# Altium schematic sheet CAN_5V.SchDoc
size A
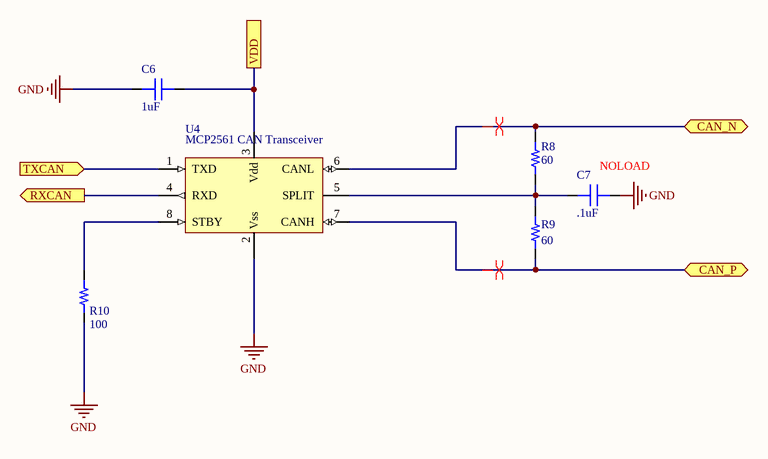
[diagram p0: CAN_5V.SchDoc]

## Parts
C6  capacitance: 1uF  [0603]  (hidden comment: capacitor)
C7  capacitance: .1uF  [0603]  (hidden comment: capacitor)
R8  60  [RES 0603/1608]
R9  60  [RES 0603/1608]
R10  100  [RES 0603/1608]
U4  MCP2561 CAN Transceiver  [SOIC-8]

## Ports
CAN_N (bidir), CAN_P (bidir), RXCAN (out), TXCAN (in), VDD

## Nets
GND: C6.1 C7.2 R10.2 U4.2(Vss)
CAN_N: R8.2 U4.6(CANL) ; port CAN_N
CAN_P: R9.2 U4.7(CANH) ; port CAN_P
RXCAN: U4.4(RXD) ; port RXCAN
TXCAN: U4.1(TXD) ; port TXCAN
VDD: C6.2 U4.3(Vdd) ; port VDD
NetC7_1: C7.1 R8.1 R9.1 U4.5(SPLIT)
NetR10_1: R10.1 U4.8(STBY)

## Layout directives
differential pair: CAN_N, CAN_P

## Notes on the sheet
- (near C7) NOLOAD

## Library data of the parts
C6 C7 = 1: Generic 0603 capacitor; id: 1; voltage: 50; dielectric: Ceramic; percent tolerance: 10; name: 0603 Capacitor; ESR: 1; package: 0603; quantity: 0
R8-R10 = 1: id: 1; name: 0603 Resistor; percent tolerance: 5; package: 0603; quantity: 0
  R8 R9: resistance: 60
  R10: resistance: 100
U4 = 5: id: 5; name: null; vcc: 0; type: CAN; package: SOIC-8; quantity: 0; link: https://www.digikey.com/product-detail/en/microchip-technology/MCP2561T-E-SN/MCP2561T-E-SNCT-ND/5148846